# EAGLE schematic Controlador repetidora (EAGLE 9.6.1)
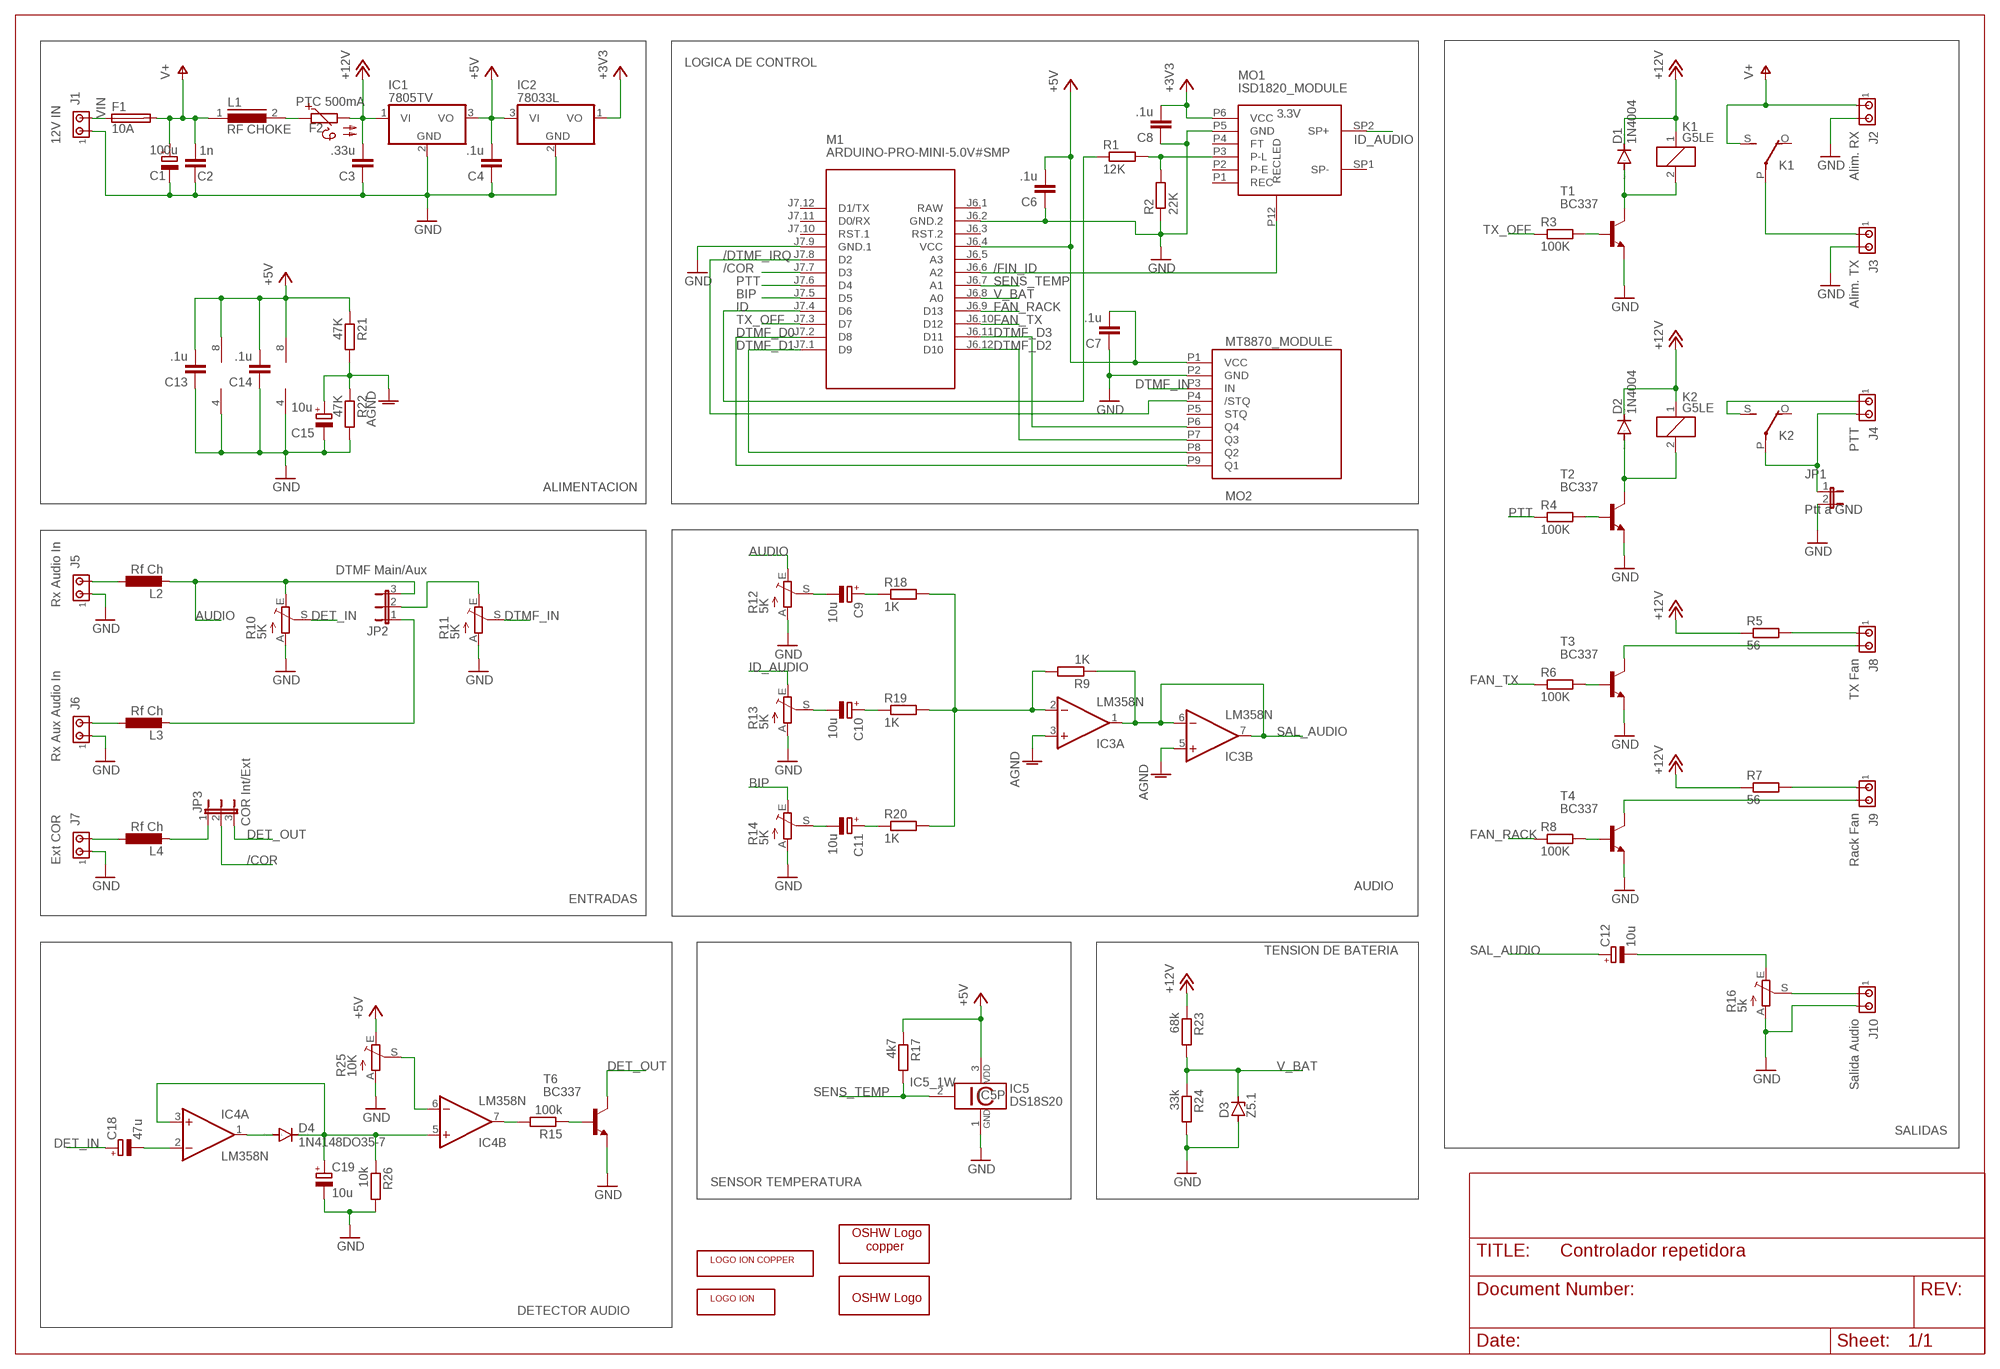
[diagram p0: schematic, sheet 1]

## Parts
C1  100u  CPOL-EUE2.5-7  [E2,5-7]
C2  1n  C-EU025-025X050  [C025-025X050]
C3  .33u  C-EU025-025X050  [C025-025X050]
C4  .1u  C-EU025-025X050  [C025-025X050]
C6  .1u  C-EU025-025X050  [C025-025X050]
C7  .1u  C-EU025-025X050  [C025-025X050]
C8  .1u  C-EU025-025X050  [C025-025X050]
C9  10u  CPOL-EUE1.8-4  [E1,8-4]
C10  10u  CPOL-EUE1.8-4  [E1,8-4]
C11  10u  CPOL-EUE1.8-4  [E1,8-4]
C12  10u  CPOL-EUE1.8-4  [E1,8-4]
C13  .1u  C-EU025-025X050  [C025-025X050]
C14  .1u  C-EU025-025X050  [C025-025X050]
C15  10u  CPOL-EUE1.8-4  [E1,8-4]
C18  47u  CPOL-EUE1.8-4  [E1,8-4]
C19  10u  CPOL-EUE1.8-4  [E1,8-4]
D1  1N4004  [DO41-10]
D2  1N4004  [DO41-10]
D3  Z5.1  ZENER-DIODEDO34-7  [DO34Z7]
D4  1N4148DO35-7  [DO35-7]
F1  10A  19559  [19559]
F2  PTC 500mA  PTC660A  [P660A]
GOLD_ORB_SM1  OSHWLOGOLOGO8MM  [OSHW_8MM]
GOLD_ORB_SM2  OSHWLOGO_COPPER8MM_COPPER  [OSHW_8MM_COPPER]
IC1  7805TV  [TO220V]
IC2  78033L  [TO92]
IC3  LM358N  [DIL08]
IC4  LM358N  [DIL08]
IC5  DS18S20  [TO92-]
J1  12V IN  MTA02-156  [1X2MTA]
J2  Alim. RX  MTA02-156  [1X2MTA]
J3  Alim. TX  MTA02-156  [1X2MTA]
J4  PTT  MTA02-100  [10X02MTA]
J5  Rx Audio In  MTA02-100  [10X02MTA]
J6  Rx Aux Audio In  MTA02-100  [10X02MTA]
J7  Ext COR  MTA02-100  [10X02MTA]
J8  TX Fan  MTA02-100  [10X02MTA]
J9  Rack Fan  MTA02-100  [10X02MTA]
J10  Salida Audio  MTA02-100  [10X02MTA]
JP1  Ptt a GND  JP1E  [JP1]
JP2  DTMF Main/Aux  JP2E  [JP2]
JP3  COR Int/Ext  JP2E  [JP2]
K1  G5LE  [G5LE]
K2  G5LE  [G5LE]
L1  RF CHOKE  82114A  [82114A]
L2  Rf Ch  L-EU0207/10  [0207/10]
L3  Rf Ch  L-EU0207/2V  [0207/2V]
L4  Rf Ch  L-EU0207/2V  [0207/2V]
M1  ARDUINO-PRO-MINI-5.0V#SMP  [ARDUINO-PRO-MINI#SMP]
MO1  ISD1820_MODULE  [ISD1820_MODULE]
MO2  MT8870_MODULE  [MT8870_MODULE]
R1  12K  R-EU_0207/12  [0207/12]
R2  22K  R-EU_0204/7  [0204/7]
R3  100K  R-EU_0207/10  [0207/10]
R4  100K  R-EU_0207/15  [0207/15]
R5  56  R-EU_0204/7  [0204/7]
R6  100K  R-EU_0207/2V  [0207/2V]
R7  56  R-EU_0204/7  [0204/7]
R8  100K  R-EU_0207/2V  [0207/2V]
R9  1K  R-EU_0204/7  [0204/7]
R10  5K  TRIM_EU-CA6H  [CA6H]
R11  5K  TRIM_EU-CA6H  [CA6H]
R12  5K  TRIM_EU-CA6H  [CA6H]
R13  5K  TRIM_EU-CA6H  [CA6H]
R14  5K  TRIM_EU-CA6H  [CA6H]
R15  100k  R-EU_0204/5  [0204/5]
R16  5k  TRIM_EU-CA6H  [CA6H]
R17  4k7  R-EU_0204/7  [0204/7]
R18  1K  R-EU_0204/7  [0204/7]
R19  1K  R-EU_0207/5V  [0207/5V]
R20  1K  R-EU_0204/7  [0204/7]
R21  47K  R-EU_0204/7  [0204/7]
R22  47K  R-EU_0207/2V  [0207/2V]
R23  68k  R-EU_0207/12  [0207/12]
R24  33k  R-EU_0204/7  [0204/7]
R25  10K  TRIM_EU-CA6V  [CA6V]
R26  10k  R-EU_0204/7  [0204/7]
T1  BC337  [TO92]
T2  BC337  [TO92]
T3  BC337  [TO92]
T4  BC337  [TO92]
T6  BC337  [TO92]
U$1  LOGO_ION  [LOGO_ION_SILK]
U$2  LOGO_ION_COOPER  [LOGO_ION_COPPER]

## Nets
+3V3: C8.2 IC2.1(VO) MO1.P6(VCC)
+5V: C4.2 C6.2 C7.2 C13.2 C14.2 IC1.3(VO) IC2.3(VI) IC3.8(P:V+) IC4.8(P:V+) IC5.3 M1.J6.4(VCC) MO2.P1(VCC) R17.1 R21.1 R25.E
+12V: C3.2 D1.C D2.C F2.2 IC1.1(VI) K1.1 K2.1 R5.1 R7.1 R23.1
/COR: JP3.2 M1.J7.7(D3)
/DTMF_IRQ: M1.J7.8(D2) MO2.P4(/STQ)
/FIN_ID: M1.J6.6(A2) MO1.P12(RECLED)
AGND: C15.+ IC3.3(A:+IN) IC3.5(B:+IN) R21.2 R22.1
AUDIO: JP2.3 L2.2 R10.E R12.E
BIP: M1.J7.5(D5) R14.E
DET_IN: C18.+ R10.S
DET_OUT: JP3.3 T6.3(C)
DTMF_D0: M1.J7.2(D8) MO2.P9(Q1)
DTMF_D1: M1.J7.1(D9) MO2.P8(Q2)
DTMF_D2: M1.J6.12(D10) MO2.P7(Q3)
DTMF_D3: M1.J6.11(D11) MO2.P6(Q4)
DTMF_IN: MO2.P3(IN) R11.S
FAN_RACK: M1.J6.9(D13) R8.1
FAN_TX: M1.J6.10(D12) R6.1
GND: C1.- C2.1 C3.1 C4.1 C6.1 C7.1 C8.1 C13.1 C14.1 C15.- C19.- D3.A IC1.2(GND) IC2.2(GND) IC3.4(P:V-) IC4.4(P:V-) IC5.1 J1.1 J2.2 J3.2 J5.1 J6.1 J7.1 J10.2 JP1.2 M1.J6.2(GND.2) M1.J7.9(GND.1) MO1.P5(GND) MO2.P2(GND) R2.1 R10.A R11.A R12.A R13.A R14.A R16.A R22.2 R24.2 R25.A R26.2 T1.1(E) T2.1(E) T3.1(E) T4.1(E) T6.1(E)
ID: M1.J7.4(D6) R1.1
ID_AUDIO: MO1.SP2(SP+) R13.E
N$1: MO1.P3(P-L) R1.2 R2.2
N$3: D1.A K1.2 T1.3(C)
N$4: J3.1 K1.P(2:P)
N$5: D2.A K2.2 T2.3(C)
N$6: J5.2 L2.1
N$7: J4.2 JP1.1 K2.P(2:P)
N$8: J4.1 K2.S(2:S)
N$9: R4.2 T2.2(B)
N$10: R3.2 T1.2(B)
N$11: J8.1 R5.2
N$12: J8.2 T3.3(C)
N$13: J9.1 R7.2
N$14: R6.2 T3.2(B)
N$15: F2.1 L1.2
N$16: J9.2 T4.3(C)
N$17: R8.2 T4.2(B)
N$18: IC3.2(A:-IN) R9.2 R18.2 R19.2 R20.2
N$19: JP2.2 R11.E
N$20: C9.- R12.S
N$21: C9.+ R18.1
N$22: J6.2 L3.1
N$23: JP2.1 L3.2
N$24: J7.2 L4.1
N$25: JP3.1 L4.2
N$26: C10.- R13.S
N$27: C10.+ R19.1
N$28: C11.- R14.S
N$29: C11.+ R20.1
N$30: IC4.7(B:OUT) R15.2
N$31: J10.1 R16.S
N$32: R15.1 T6.2(B)
N$33: C12.- R16.E
N$36: C18.- IC4.2(A:-IN)
N$38: C19.+ D4.C IC4.3(A:+IN) IC4.5(B:+IN) R26.1
N$42: IC4.6(B:-IN) R25.S
N$43: D4.A IC4.1(A:OUT)
PTT: M1.J7.6(D4) R4.1
SAL_AUDIO: C12.+ IC3.1(A:OUT) IC3.6(B:-IN) IC3.7(B:OUT) R9.1
SENS_TEMP: IC5.2 M1.J6.7(A1) R17.2
TX_OFF: M1.J7.3(D7) R3.1
V+: C1.+ C2.2 F1.2 J2.1 K1.S(2:S) L1.1
V_BAT: D3.C M1.J6.8(A0) R23.2 R24.1
VIN: F1.1 J1.2
Unconnected: K1.O(2:O) K2.O(2:O) M1.J6.3(RST.2) M1.J6.5(A3) M1.J7.10(RST.1) M1.J7.11(D0/RX) M1.J7.12(D1/TX) MO1.P1(REC) MO1.P2(P-E) MO1.P4(FT) MO1.SP1(SP-) MO2.P5(STQ)

## Notes on the sheet
- LOGICA DE CONTROL
- ALIMENTACION
- AUDIO
- ENTRADAS
- TENSION DE BATERIA
- SALIDAS
- SENSOR TEMPERATURA
- DETECTOR AUDIO

## Power pins joined to a net without a drawn wire
RAW: M1.J6.1(RAW)

## Library data of the parts
C1 C9-C12 C15 C18 C19 = rcl:CPOL-EU: POLARIZED CAPACITOR, European symbol; SPICEPREFIX: C
C2-C4 C6-C8 C13 C14 = rcl:C-EU: CAPACITOR, European symbol; SPICEPREFIX: C
D1 D2 = diode:1N4004: DIODE general purpose rectifier, 1 A
D3 = diode:ZENER-DIODE: Z-Diode
D4 = diode:1N4148: DIODE high speed (Philips)
F1 = fuse:19559: FUSE HOLDER TR5, Wickmann; MPN: 55900000001; OC_FARNELL: 9516360; OC_NEWARK: 02P0286
F2 = ptc-ntc:PTC660A: PHILIPS PTC; OC_FARNELL: unknown; OC_NEWARK: unknown
GOLD_ORB_SM1 = oshw:OSHWLOGO: The OSHW logo for PCB layout
GOLD_ORB_SM2 = oshw:OSHWLOGO_COPPER: The OSHW logo for PCB layout
IC1 = linear:78*: Positive VOLTAGE REGULATOR Source: http://cache.national.com/ds/LM/LM78L05.pdf http://www.fairchildsemi.com/ds/LM/LM7805.pdf
IC2 = User:78033: Positive VOLTAGE REGULATOR 3.3v
IC3 IC4 = linear:LM358: OP AMP also LM158; LM258; LM2904 Source: http://cache.national.com/ds/LM/LM158.pdf
IC5 = 1wire:DS18S20: High Precision Digital Thermometer This chip provides a onewire thermosensor with approx. 0.5°C accuracy.A programmable over/undertemperure alarm is available. Notes: Vdd must be applied for accurate measurements at low temperatures, as the parasite power circuit otherwise heats the sensor. If parasite power is used, Vdd has to be connected to GND. The DS1822 is a low-cost thermometer chip, the DS18B20 is similar to the DS18S20, but with 9..12 Bit programmable precision. Author: Jan Kandziora <jjj@gmx.de>
J1-J3 = con-amp:MTA02-156: AMP connector
J4-J10 = con-amp:MTA02-100: AMP connector
JP1 = jumper:JP1E: JUMPER
JP2 JP3 = jumper:JP2E: JUMPER
K1 K2 = relay:G5LE: RELAY 1 x switch, 10 A/120 V AC, 8 A/30 V DC, Omron; OC_FARNELL: unknown; OC_NEWARK: unknown
L1 = inductors:82114A: INDUCTOR; SPICEPREFIX: L
L2-L4 = rcl:L-EU: INDUCTOR, European symbol; SPICEPREFIX: L
M1 = diy-modules:ARDUINO-PRO-MINI-*#SMP: Arduino Pro Mini (and compatible devices) with 2 connectors only More details available here: https://www.arduino.cc/en/Main/ArduinoBoardProMini Click here to find device on ebay.com <http://www.ebay.com/sch/arduino+pro+mini>
MO1 = User:ISD1820_MODULE: ISD1820 Audio rec/play module
MO2 = User:MT8870_MODULE: MT8870 DTMF Decoder module
R1-R9 R15 R17-R24 R26 = rcl:R-EU_: RESISTOR, European symbol; SPICEPREFIX: R
R10-R14 R16 R25 = pot:TRIM_EU-: POTENTIOMETER
T1-T4 T6 = transistor:BC337: NPN TRANSISTOR
U$1 = User:LOGO_ION
U$2 = User:LOGO_ION_COOPER